# EAGLE schematic RobotBoard_v1.0 (EAGLE 6.1)
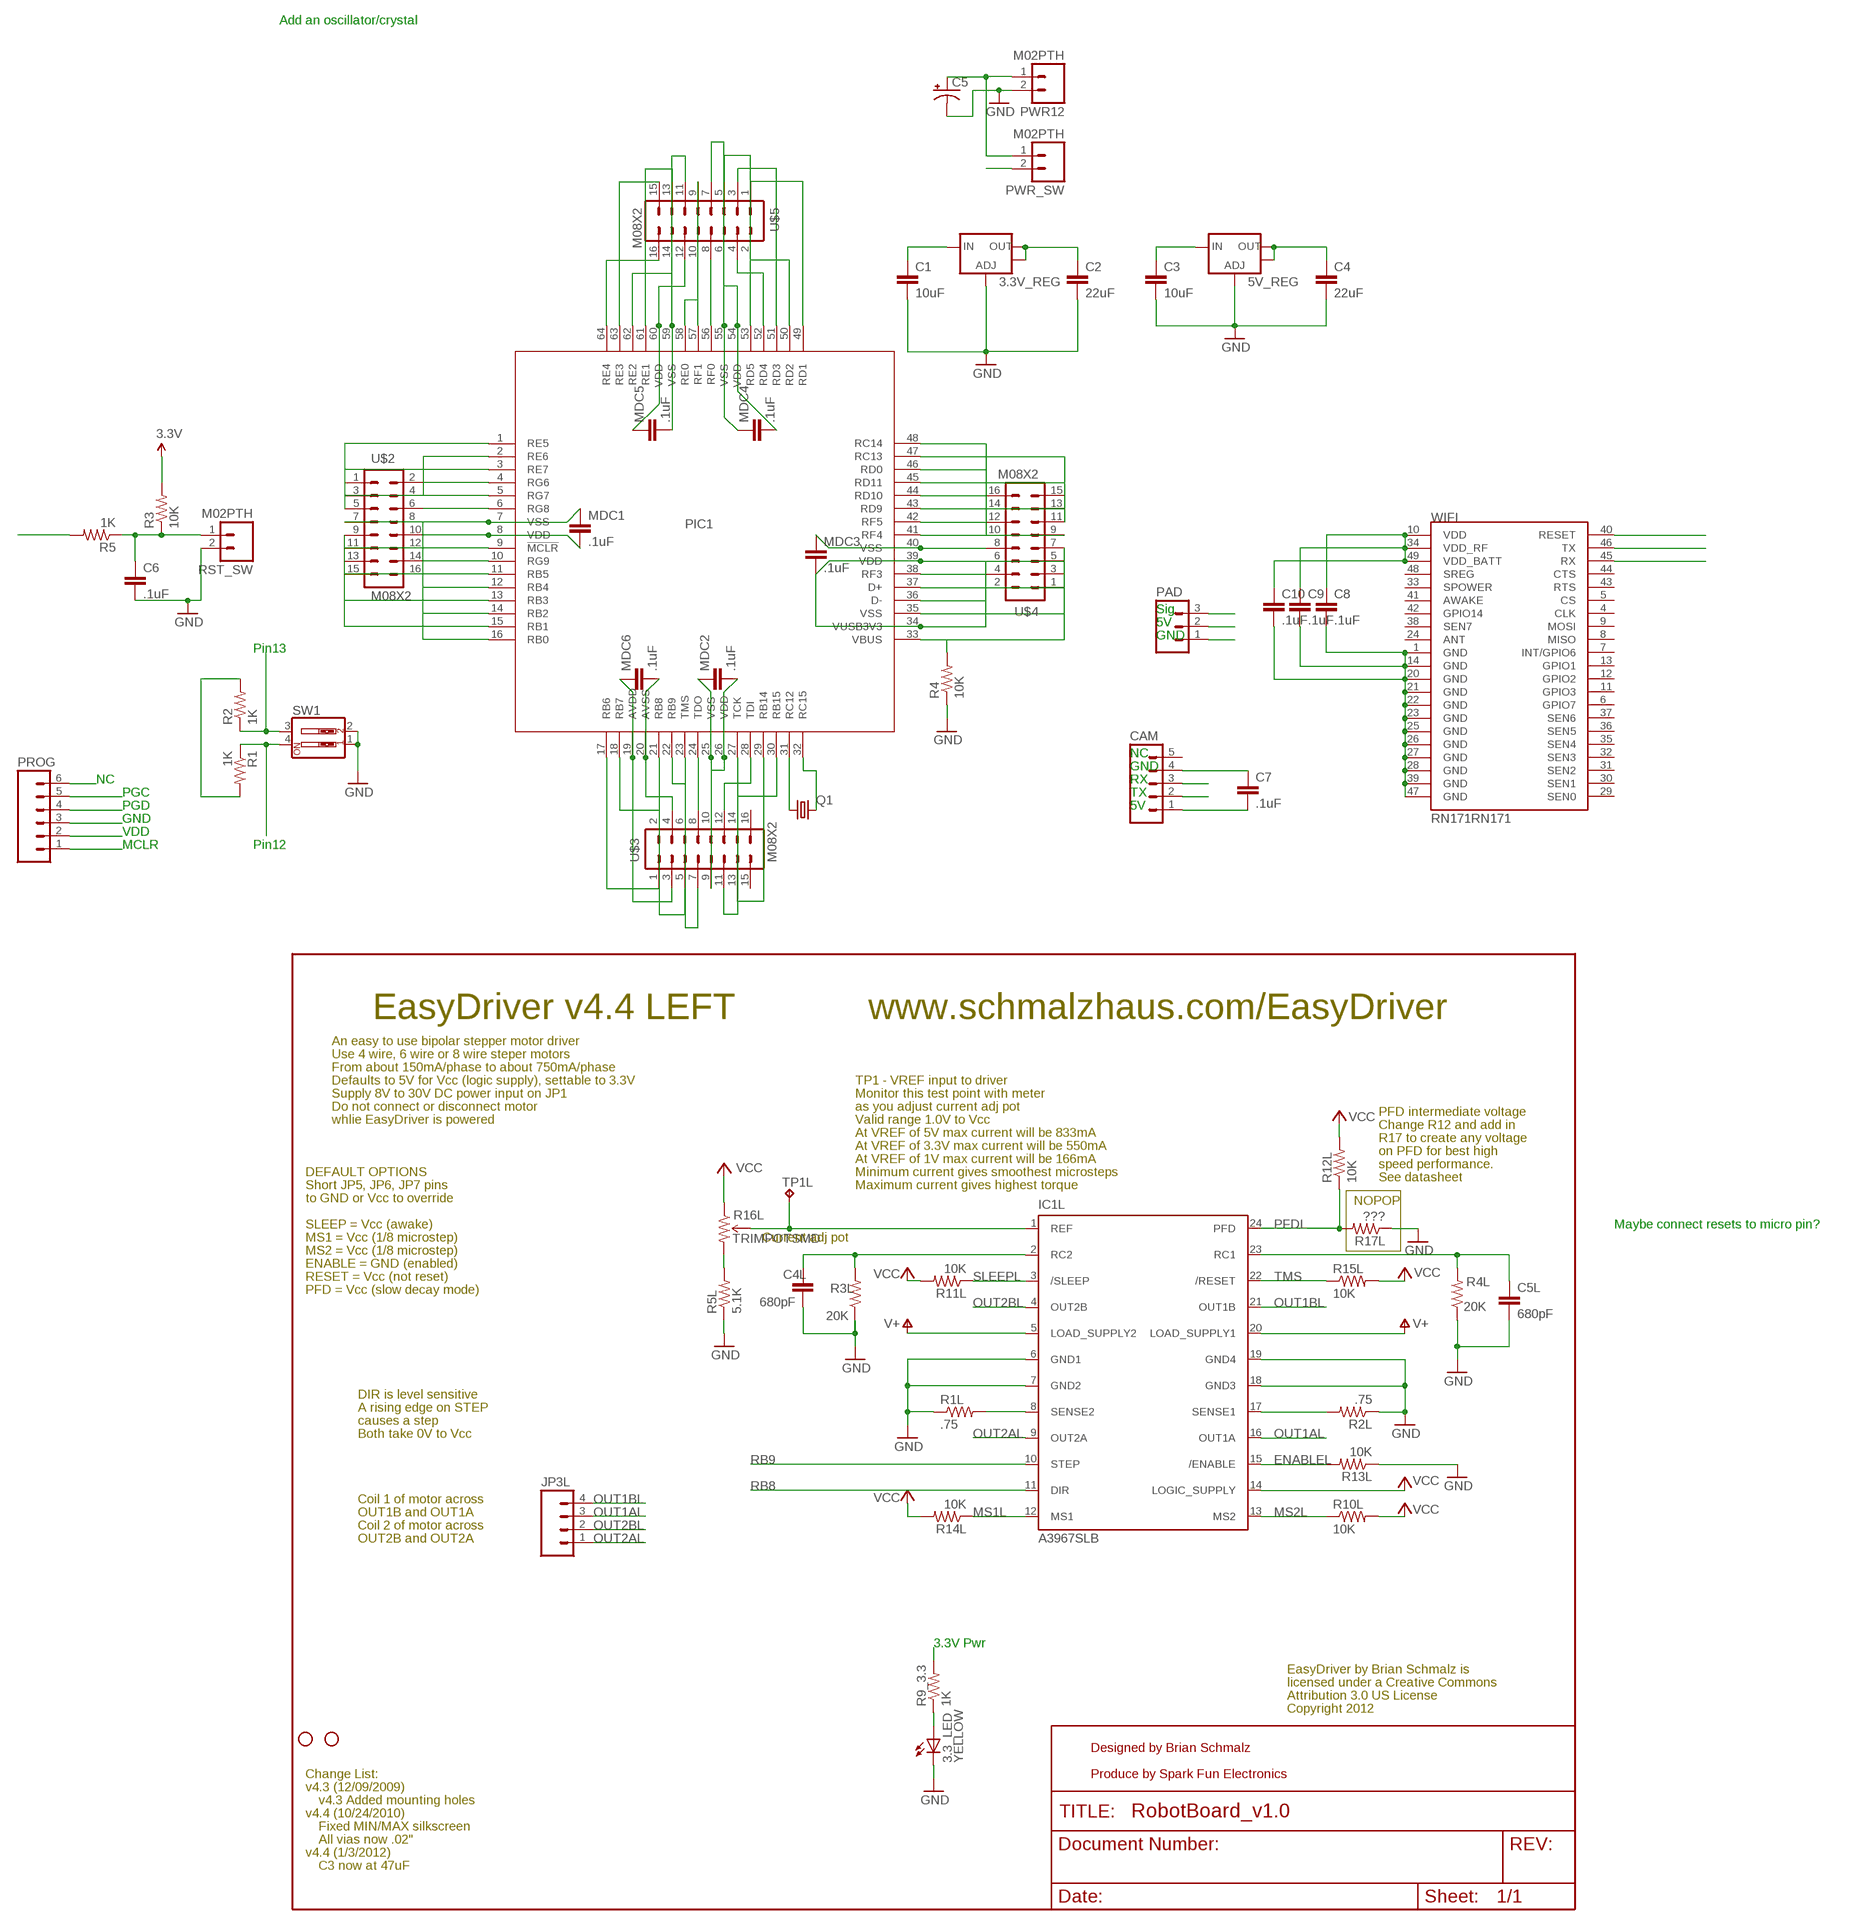
[diagram p0: schematic, sheet 1, part 1 of 2]
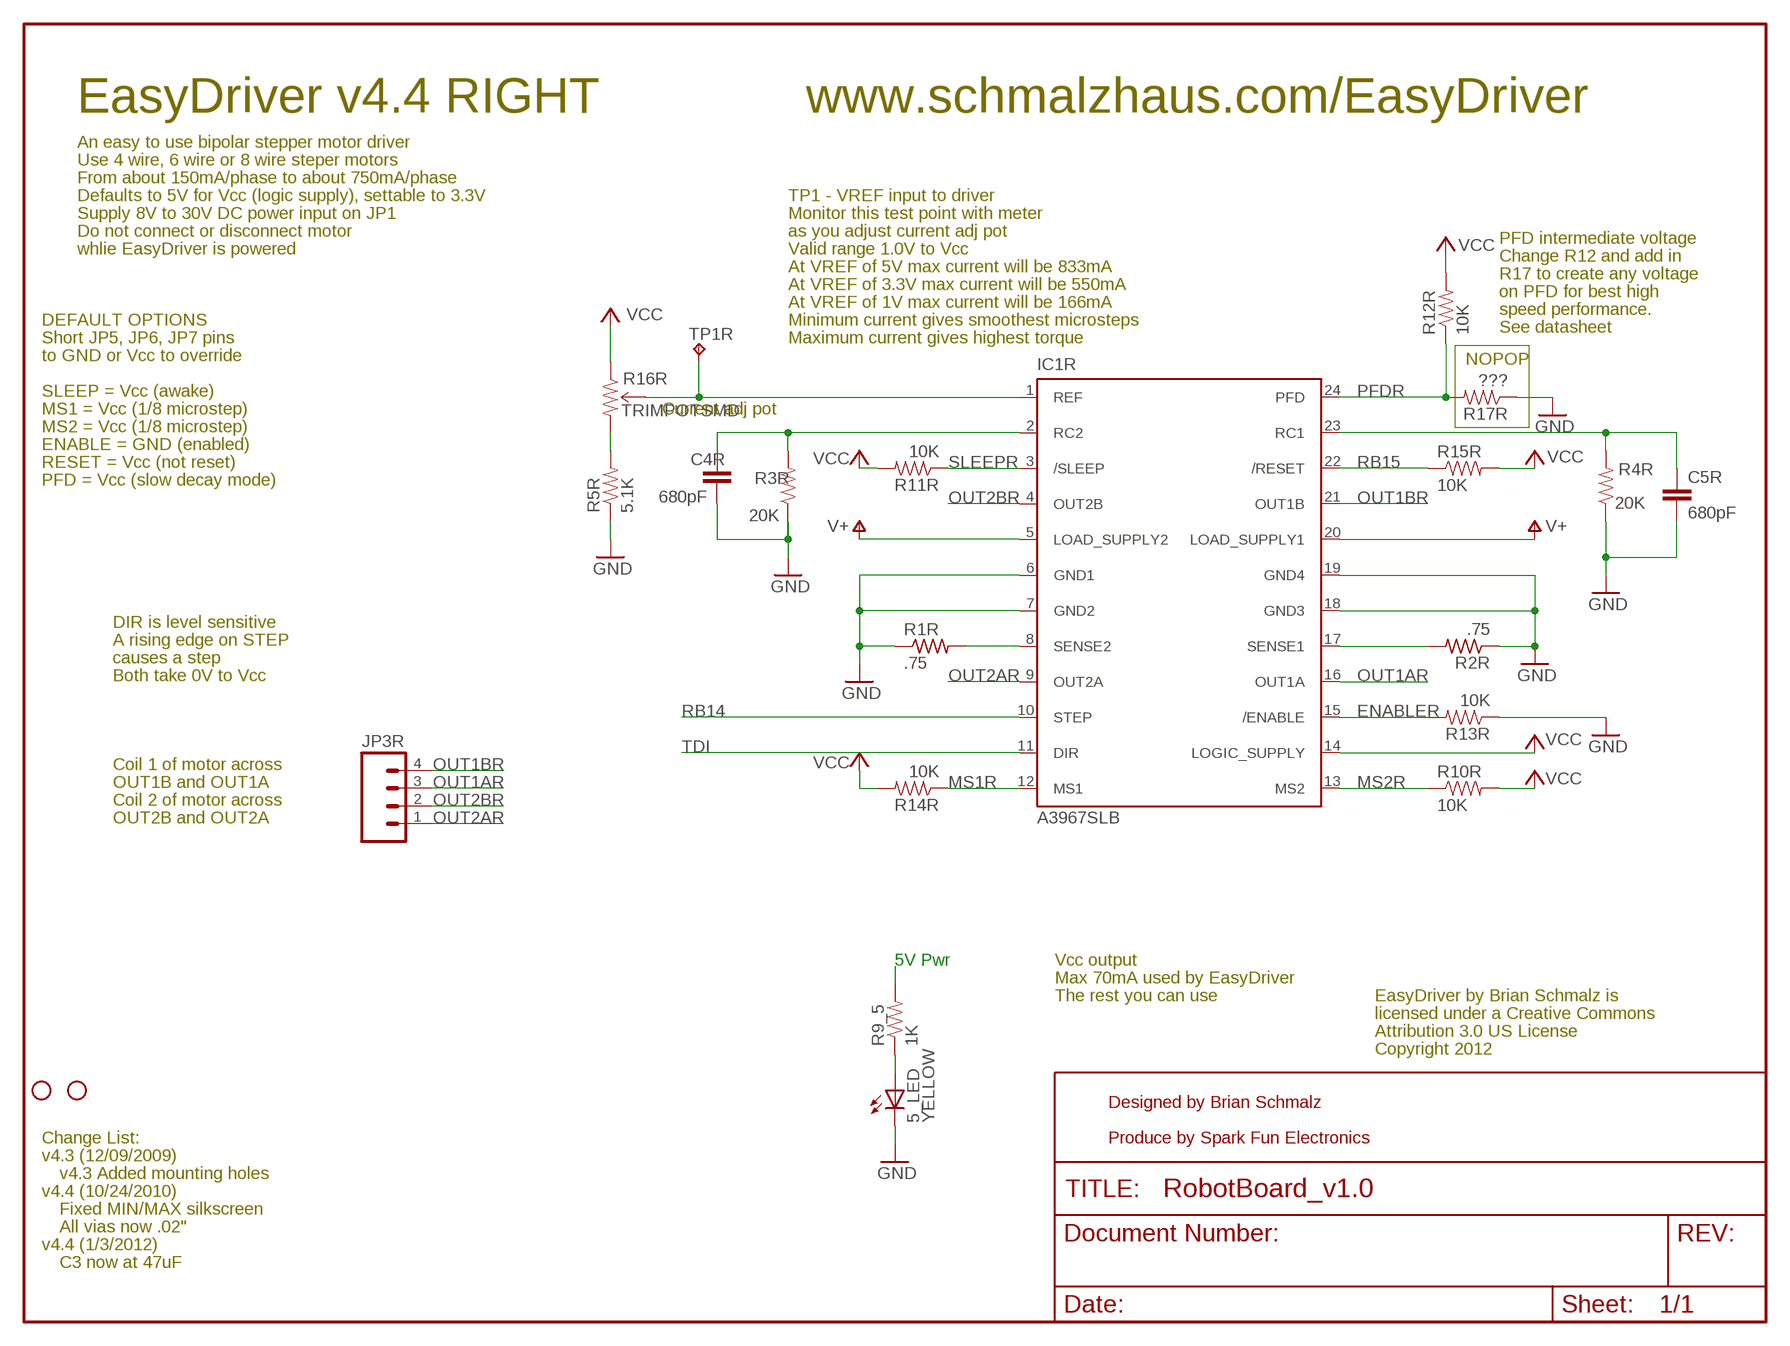
[diagram p1: schematic, sheet 1, part 2 of 2]

## Parts
3.3_LED  YELLOW  LED0603  [LED-0603]
3.3V_REG  V_REG_LM1117SOT223  [SOT223]
5_LED  YELLOW  LED0603  [LED-0603]
5V_REG  V_REG_LM1117SOT223  [SOT223]
C1  10uF  CAP0603  [0603]
C2  22uF  CAP0603  [0603]
C3  10uF  CAP0603  [0603]
C4  22uF  CAP0603  [0603]
C4L  680pF  CAP0402  [C0402]
C4R  680pF  CAP0402  [C0402]
C5  CAP_POLPTH4  [CPOL-RADIAL-1000UF-25V]
C5L  680pF  CAP0402  [C0402]
C5R  680pF  CAP0402  [C0402]
C6  .1uF  CAP0603  [0603]
C7  .1uF  CAP0603  [0603]
C8  .1uF  CAP0603  [0603]
C9  .1uF  CAP0603  [0603]
C10  .1uF  CAP0603  [0603]
CAM  M05LOCK  [1X05_LOCK]
IC1L  A3967SLB  [SO24W]
IC1R  A3967SLB  [SO24W]
JP1  STAND-OFF  [STAND-OFF]
JP2  STAND-OFF  [STAND-OFF]
JP3L  M041X04_NO_SILK  [1X04_NO_SILK]
JP3R  M041X04_NO_SILK  [1X04_NO_SILK]
JP8  STAND-OFF  [STAND-OFF]
JP9  STAND-OFF  [STAND-OFF]
MDC1  .1uF  CAP0603  [0603]
MDC2  .1uF  CAP0603  [0603]
MDC3  .1uF  CAP0603  [0603]
MDC4  .1uF  CAP0603  [0603]
MDC5  .1uF  CAP0603  [0603]
MDC6  .1uF  CAP0603  [0603]
PAD  M03POLAR  [MOLEX-1X3]
PIC1  PIC32MZ2048ECM064  [TQFP64-10X10X1MM]
PROG  M06LOCK  [1X06_LOCK]
PWR12  M02PTH  [1X02]
PWR_SW  M02PTH  [1X02]
Q1  CRYSTALHC49UP  [HC49UP]
R1  1K  RESISTOR0402  [C0402]
R1L  .75  R-US_R0805  [R0805]
R1R  .75  R-US_R0805  [R0805]
R2  1K  RESISTOR0402  [C0402]
R2L  .75  R-US_R0805  [R0805]
R2R  .75  R-US_R0805  [R0805]
R3  10K  RESISTOR0402  [C0402]
R3L  20K  RESISTOR0402  [C0402]
R3R  20K  RESISTOR0402  [C0402]
R4  10K  RESISTOR0402  [C0402]
R4L  20K  RESISTOR0402  [C0402]
R4R  20K  RESISTOR0402  [C0402]
R5  1K  RESISTOR0402  [C0402]
R5L  5.1K  RESISTOR0402  [C0402]
R5R  5.1K  RESISTOR0402  [C0402]
R9_3.3  1K  RESISTOR0402  [C0402]
R9_5  1K  RESISTOR0402  [C0402]
R10L  10K  RESISTOR0402  [C0402]
R10R  10K  RESISTOR0402  [C0402]
R11L  10K  RESISTOR0402  [C0402]
R11R  10K  RESISTOR0402  [C0402]
R12L  10K  RESISTOR0402  [C0402]
R12R  10K  RESISTOR0402  [C0402]
R13L  10K  RESISTOR0402  [C0402]
R13R  10K  RESISTOR0402  [C0402]
R14L  10K  RESISTOR0402  [C0402]
R14R  10K  RESISTOR0402  [C0402]
R15L  10K  RESISTOR0402  [C0402]
R15R  10K  RESISTOR0402  [C0402]
R16L  TRIMPOTSMD  [TRIMPOT-3MM]
R16R  TRIMPOTSMD  [TRIMPOT-3MM]
R17L  ???  RESISTOR0402  [C0402]
R17R  ???  RESISTOR0402  [C0402]
RST_SW  M02PTH  [1X02]
SW1  SW_DIP-2  [DIPSWITCH-02]
TP1L  TPPAD1-13  [P1-13]
TP1R  TPPAD1-13  [P1-13]
U$2  M08X2  [2X8]
U$3  M08X2  [2X8]
U$4  M08X2  [2X8]
U$5  M08X2  [2X8]
WIFI  RN171RN171  [RN171]

## Nets
3.3V: 3.3V_REG.2(OUT) 3.3V_REG.4(OUT) C2.1 C8.1 C9.1 C10.1 IC1L.14(LOGIC_SUPPLY) IC1R.14(LOGIC_SUPPLY) MDC1.2 MDC2.2 MDC3.2 MDC4.2 MDC5.1 MDC6.1 PIC1.8(VDD) PIC1.19(AVDD) PIC1.26(VDD) PIC1.34(VUSB3V3) PIC1.39(VDD) PIC1.54(VDD) PIC1.60(VDD) PROG.2 R1.2 R2.2 R3.2 R9_3.3.2 R10L.2 R10R.2 R11L.2 R11R.2 R12L.2 R12R.2 R14L.2 R14R.2 R15L.2 R15R.2 R16L.1(CCW) R16R.1(CCW) U$2.8 U$3.3 U$3.10 U$4.2 U$4.7 U$5.6 U$5.12 WIFI.10(VDD) WIFI.34(VDD_RF) WIFI.49(VDD_BATT) ; supply symbol labelled VCC
5V: 5V_REG.2(OUT) 5V_REG.4(OUT) C4.1 C7.2 CAM.1 PAD.2 R9_5.2
12V: 3.3V_REG.3(IN) 5V_REG.3(IN) C1.1 C3.1 IC1L.5(LOAD_SUPPLY2) IC1L.20(LOAD_SUPPLY1) IC1R.5(LOAD_SUPPLY2) IC1R.20(LOAD_SUPPLY1) PWR_SW.2 ; supply symbol labelled V+
!MCLR: PIC1.9(!MCLR) PROG.1 R5.2 U$2.9
A44: C6.1 R3.1 R5.1 RST_SW.1
D+: PIC1.37(D+) U$4.5
D-: PIC1.36(D-) U$4.4
ENABLEL: IC1L.15(/ENABLE) R13L.2
ENABLER: IC1R.15(/ENABLE) R13R.2
GND: 3.3_LED.C 3.3V_REG.1(ADJ) 5_LED.C 5V_REG.1(ADJ) C1.2 C2.2 C3.2 C4.2 C4L.2 C4R.2 C5.2(-) C5L.2 C5R.2 C6.2 C7.1 C8.2 C9.2 C10.2 CAM.4 IC1L.6(GND1) IC1L.7(GND2) IC1L.18(GND3) IC1L.19(GND4) IC1R.6(GND1) IC1R.7(GND2) IC1R.18(GND3) IC1R.19(GND4) MDC1.1 MDC2.1 MDC3.1 MDC4.1 MDC5.2 MDC6.2 PAD.1 PIC1.7(VSS) PIC1.20(AVSS) PIC1.25(VSS) PIC1.35(VSS) PIC1.40(VSS) PIC1.55(VSS) PIC1.59(VSS) PROG.3 PWR12.2 R1L.1 R1R.1 R2L.1 R2R.1 R3L.1 R3R.1 R4.1 R4L.1 R4R.1 R5L.1 R5R.1 R13L.1 R13R.1 R17L.1 R17R.1 RST_SW.2 SW1.1 SW1.2 U$2.7 U$3.4 U$3.9 U$4.3 U$4.8 U$5.7 U$5.11 WIFI.1(GND) WIFI.14(GND) WIFI.20(GND) WIFI.21(GND) WIFI.22(GND) WIFI.23(GND) WIFI.25(GND) WIFI.26(GND) WIFI.27(GND) WIFI.28(GND) WIFI.39(GND) WIFI.47(GND)
MS1L: IC1L.12(MS1) R14L.1
MS1R: IC1R.12(MS1) R14R.1
MS2L: IC1L.13(MS2) R10L.1
MS2R: IC1R.13(MS2) R10R.1
N$1: IC1L.8(SENSE2) R1L.2
N$2: 3.3_LED.A R9_3.3.1
N$3: IC1L.17(SENSE1) R2L.2
N$5: C4L.1 IC1L.2(RC2) R3L.2
N$6: PIC1.31(RC12) Q1.1
N$7: C5L.1 IC1L.23(RC1) R4L.2
N$8: IC1R.8(SENSE2) R1R.2
N$9: IC1R.17(SENSE1) R2R.2
N$10: C4R.1 IC1R.2(RC2) R3R.2
N$11: R5L.2 R16L.3(CW)
N$12: IC1L.1(REF) R16L.2(WIPER) TP1L.1(TP)
N$13: C5R.1 IC1R.23(RC1) R4R.2
N$14: IC1R.1(REF) R16R.2(WIPER) TP1R.1(TP)
N$15: PIC1.32(RC15) Q1.2
N$16: R5R.2 R16R.3(CW)
N$17: 5_LED.A R9_5.1
N$19: C5.1(+) PWR12.1 PWR_SW.1
N$34: PROG.6
OUT1AL: IC1L.16(OUT1A) JP3L.3
OUT1AR: IC1R.16(OUT1A) JP3R.3
OUT1BL: IC1L.21(OUT1B) JP3L.4
OUT1BR: IC1R.21(OUT1B) JP3R.4
OUT2AL: IC1L.9(OUT2A) JP3L.1
OUT2AR: IC1R.9(OUT2A) JP3R.1
OUT2BL: IC1L.4(OUT2B) JP3L.2
OUT2BR: IC1R.4(OUT2B) JP3R.2
PFDL: IC1L.24(PFD) R12L.1 R17L.2
PFDR: IC1R.24(PFD) R12R.1 R17R.2
RB0: PIC1.16(RB0) PROG.4 U$2.16
RB1: PIC1.15(RB1) PROG.5 U$2.15
RB2: PIC1.14(RB2) U$2.14
RB3: PIC1.13(RB3) R2.1 SW1.3 U$2.13
RB4: PIC1.12(RB4) R1.1 SW1.4 U$2.12
RB5: PIC1.11(RB5) U$2.11
RB6: PIC1.17(RB6) U$3.1
RB7: PIC1.18(RB7) U$3.2
RB8: IC1L.11(DIR) PIC1.21(RB8) U$3.5
RB9: IC1L.10(STEP) PIC1.22(RB9) U$3.6
RB14: IC1R.10(STEP) PIC1.29(RB14) U$3.13
RB15: IC1R.22(/RESET) PIC1.30(RB15) R15R.1 U$3.14
RC13: PIC1.47(RC13) U$4.15
RC14: PIC1.48(RC14) U$4.16
RD0: CAM.3 PIC1.46(RD0) U$4.14
RD1: PIC1.49(RD1) U$5.1
RD2: PIC1.50(RD2) U$5.2
RD3: PIC1.51(RD3) U$5.3
RD4: PIC1.52(RD4) U$5.4
RD5: PIC1.53(RD5) U$5.5
RD9: CAM.2 PIC1.43(RD9) U$4.11
RD10: PIC1.44(RD10) U$4.12
RD11: PIC1.45(RD11) U$4.13
RE0: PIC1.58(RE0) U$5.10
RE1: PIC1.61(RE1) U$5.13
RE2: PIC1.62(RE2) U$5.14
RE3: PIC1.63(RE3) U$5.15
RE4: PIC1.64(RE4) U$5.16
RE5: PIC1.1(RE5) U$2.1
RE6: PIC1.2(RE6) U$2.2
RE7: PIC1.3(RE7) U$2.3
RF0: PIC1.56(RF0) U$5.8
RF1: PIC1.57(RF1) U$5.9
RF3: PAD.3 PIC1.38(RF3) U$4.6
RF4: PIC1.41(RF4) U$4.9
RF5: PIC1.42(RF5) U$4.10
RG6: PIC1.4(RG6) U$2.4 WIFI.40(RESET)
RG7: PIC1.5(RG7) U$2.5 WIFI.45(RX)
RG8: PIC1.6(RG8) U$2.6 WIFI.46(TX)
RG9: PIC1.10(RG9) U$2.10
SLEEPL: IC1L.3(/SLEEP) R11L.1
SLEEPR: IC1R.3(/SLEEP) R11R.1
TCK: PIC1.27(TCK) U$3.11
TDD: PIC1.24(TDO) U$3.8
TDI: IC1R.11(DIR) PIC1.28(TDI) U$3.12
TMS: IC1L.22(/RESET) PIC1.23(TMS) R15L.1 U$3.7
VBUS: PIC1.33(VBUS) R4.2 U$4.1
Unconnected: CAM.5 U$3.15 U$3.16 WIFI.4(CLK) WIFI.5(CS) WIFI.6(GPIO7) WIFI.7(INT/GPIO6) WIFI.8(MISO) WIFI.9(MOSI) WIFI.11(GPIO3) WIFI.12(GPIO2) WIFI.13(GPIO1) WIFI.24(ANT) WIFI.29(SEN0) WIFI.30(SEN1) WIFI.31(SEN2) WIFI.32(SEN3) WIFI.33(SPOWER) WIFI.35(SEN4) WIFI.36(SEN5) WIFI.37(SEN6) WIFI.38(SEN7) WIFI.41(AWAKE) WIFI.42(GPIO14) WIFI.43(RTS) WIFI.44(CTS) WIFI.48(SREG)

## Notes on the sheet
- Add an oscillator/crystal
- Sig
- 5V
- GND
- Pin13
- NC
- GND
- NC | RX
- PGC | TX
- PGD | 5V
- GND
- VDD
- MCLR | Pin12
- EasyDriver v4.4 LEFT | www.schmalzhaus.com/EasyDriver
- An easy to use bipolar stepper motor driver
- Use 4 wire, 6 wire or 8 wire steper motors
- From about 150mA/phase to about 750mA/phase
- Defaults to 5V for Vcc (logic supply), settable to 3.3V | TP1 - VREF input to driver
- Supply 8V to 30V DC power input on JP1 | Monitor this test point with meter
- Do not connect or disconnect motor | as you adjust current adj pot
- PFD intermediate voltage
- whlie EasyDriver is powered | Valid range 1.0V to Vcc
- Change R12 and add in
- At VREF of 5V max current will be 833mA
- R17 to create any voltage
- At VREF of 3.3V max current will be 550mA
- on PFD for best high
- At VREF of 1V max current will be 166mA
- speed performance.
- DEFAULT OPTIONS | Minimum current gives smoothest microsteps
- See datasheet
- Short JP5, JP6, JP7 pins | Maximum current gives highest torque
- to GND or Vcc to override | NOPOP
- SLEEP = Vcc (awake) | Maybe connect resets to micro pin?
- MS1 = Vcc (1/8 microstep) | Current adj pot
- MS2 = Vcc (1/8 microstep)
- ENABLE = GND (enabled)
- RESET = Vcc (not reset)
- PFD = Vcc (slow decay mode)
- DIR is level sensitive
- A rising edge on STEP
- causes a step
- Both take 0V to Vcc
- Coil 1 of motor across
- OUT1B and OUT1A
- Coil 2 of motor across
- OUT2B and OUT2A
- 3.3V Pwr
- EasyDriver by Brian Schmalz is
- licensed under a Creative Commons
- Attribution 3.0 US License
- Copyright 2012
- Designed by Brian Schmalz
- Change List: | Produce by Spark Fun Electronics
- v4.3 (12/09/2009)
- v4.3 Added mounting holes
- v4.4 (10/24/2010)
- Fixed MIN/MAX silkscreen
- All vias now .02"
- v4.4 (1/3/2012)
- C3 now at 47uF
- EasyDriver v4.4 RIGHT | www.schmalzhaus.com/EasyDriver
- An easy to use bipolar stepper motor driver
- Use 4 wire, 6 wire or 8 wire steper motors
- From about 150mA/phase to about 750mA/phase
- Defaults to 5V for Vcc (logic supply), settable to 3.3V | TP1 - VREF input to driver
- Supply 8V to 30V DC power input on JP1 | Monitor this test point with meter
- Do not connect or disconnect motor | as you adjust current adj pot
- PFD intermediate voltage
- whlie EasyDriver is powered | Valid range 1.0V to Vcc
- Change R12 and add in
- At VREF of 5V max current will be 833mA
- R17 to create any voltage
- At VREF of 3.3V max current will be 550mA
- on PFD for best high
- At VREF of 1V max current will be 166mA
- speed performance.
- DEFAULT OPTIONS | Minimum current gives smoothest microsteps
- See datasheet
- Short JP5, JP6, JP7 pins | Maximum current gives highest torque
- to GND or Vcc to override | NOPOP
- SLEEP = Vcc (awake)
- MS1 = Vcc (1/8 microstep) | Current adj pot
- MS2 = Vcc (1/8 microstep)
- ENABLE = GND (enabled)
- RESET = Vcc (not reset)
- PFD = Vcc (slow decay mode)
- DIR is level sensitive
- A rising edge on STEP
- causes a step
- Both take 0V to Vcc
- Coil 1 of motor across
- OUT1B and OUT1A
- Coil 2 of motor across
- OUT2B and OUT2A
- 5V Pwr | Vcc output
- Max 70mA used by EasyDriver
- The rest you can use | EasyDriver by Brian Schmalz is
- licensed under a Creative Commons
- Attribution 3.0 US License
- Copyright 2012
- Designed by Brian Schmalz
- Change List: | Produce by Spark Fun Electronics
- v4.3 (12/09/2009)
- v4.3 Added mounting holes
- v4.4 (10/24/2010)
- Fixed MIN/MAX silkscreen
- All vias now .02"
- v4.4 (1/3/2012)
- C3 now at 47uF

## Library data of the parts
3.3_LED 5_LED = SparkFun03_30_09:LED: LEDs Standard schematic elements and footprints for 5mm, 3mm, 1206, and 0603 sized LEDs. 5mm - Spark Fun Electronics SKU : COM-00529 (and others)
3.3V_REG 5V_REG = SparkFun-PowerIC:V_REG_LM1117: Voltage Regulator LM1117 Standard adjustable voltage regulator but in SMD form. Spark Fun Electronics SKU : COM-00595; PROD_ID: VREG-08170
C1-C4 C6-C10 MDC1-MDC6 = SparkFun-2-11-09:CAP: Capacitor Standard 0603 ceramic capacitor, and 0.1" leaded capacitor.
C4L C4R C5L C5R = SparkFun03_30_09:CAP: Capacitor Standard 0603 ceramic capacitor, and 0.1" leaded capacitor.
C5 = SparkFun-Capacitors:CAP_POL: Capacitor Polarized These are standard SMD and PTH capacitors. Normally 10uF, 47uF, and 100uF in electrolytic and tantalum varieties. Always verify the external diameter of the through hole cap, it varies with capacity, voltage, and manufacturer. The EIA devices should be standard.
CAM = SparkFun-Connectors:M05: Header 5 Standard 5-pin 0.1" header. Use with straight break away headers (SKU : PRT-00116), right angle break away headers (PRT-00553), swiss pins (PRT-00743), machine pins (PRT-00117), and female headers (PRT-00115). Molex polarized connector foot print use with SKU : PRT-08230 with associated crimp pins and housings.
IC1L IC1R = Allegro:A3967SLB: ANALOG DEVICES
JP1 JP2 JP8 JP9 = SparkFun-7-28-09:STAND-OFF: Stand Off This is the mechanical footprint for a #4 phillips button head screw. Use the keepout ring to avoid running the screw head into surrounding components. SKU : PRT-00447
JP3L JP3R = SparkFun:M04: Header 4 Standard 4-pin 0.1" header. Use with straight break away headers (SKU : PRT-00116), right angle break away headers (PRT-00553), swiss pins (PRT-00743), machine pins (PRT-00117), and female headers (PRT-00115). Molex polarized connector foot print use with SKU : PRT-08231 with associated crimp pins and housings.
PAD = SparkFun-Connectors:M03: Header 3 Standard 3-pin 0.1" header. Use with straight break away headers (SKU : PRT-00116), right angle break away headers (PRT-00553), swiss pins (PRT-00743), machine pins (PRT-00117), and female headers (PRT-00115). Molex polarized connector foot print use with SKU : PRT-08232 with associated crimp pins and housings.
PIC1 = microchip:PIC32MZ2048ECM064: PIC32MZ2048ECM064 Microchip microcontroller TQFP64 10x10x1
PROG = SparkFun-Connectors:M06: Header 6 Standard 6-pin 0.1" header. Use with straight break away headers (SKU : PRT-00116), right angle break away headers (PRT-00553), swiss pins (PRT-00743), machine pins (PRT-00117), and female headers (PRT-00115). Molex polarized connector foot print use with SKU : PRT-08094 with associated crimp pins and housings. NOTES ON THE VARIANTS LOCK and LOCK_LONGPADS... This footprint was designed to help hold the alignment of a through-hole component (i.e. 6-pin header) while soldering it into place. You may notice that each hole has been shifted either up or down by 0.005 of an inch from it's more standard position (which is a perfectly straight line). This slight alteration caused the pins (the squares in the middle) to touch the edges of the holes. Because they are alternating, it causes a "brace" to hold the component in place. 0.005 has proven to be the perfect amount of "off-center" position when using our standard breakaway headers. Although looks a little odd when you look at the bare footprint, once you have a header in there, the alteration is very hard to notice. Also,if you push a header all the way into place, it is covered up entirely on the bottom side. This idea of altering the position of holes to aid alignment will be further integrated into the Sparkfun Library for other footprints. It can help hold any component with 3 or more connection pins.
PWR12 PWR_SW RST_SW = SparkFun-Connectors:M02: Standard 2-pin 0.1" header. Use with - straight break away headers ( PRT-00116) - right angle break away headers (PRT-00553) - swiss pins (PRT-00743) - machine pins (PRT-00117) - female headers (PRT-00115) Molex polarized connector foot print use with: PRT-08233 with associated crimp pins and housings. 2.54_SCREWTERM for use with PRT-10571. 3.5mm Screw Terminal footprints for PRT-08084 5mm Screw Terminal footprints for use with PRT-08433
Q1 = crystal:CRYSTAL: CRYSTAL; OC_FARNELL: unknown; OC_NEWARK: unknown
R1-R3 R3L R3R R4 R4L R4R R5 R5L R5R R9_3.3 R9_5 R10L R10R R11L R11R R12L R12R R13L R13R R14L R14R R15L R15R R17L R17R = SparkFun03_30_09:RESISTOR: Resistor Basic schematic elements and footprints for 0603, 1206, and PTH 1/10th watt (small) resistors.
R1L R1R R2L R2R = rcl:R-US_: RESISTOR, American symbol
R16L R16R = SparkFun:TRIMPOT
SW1 = SparkFun-Electromechanical:SW_DIP-2: DIP SWITCH
TP1L TP1R = testpad:TP
U$2-U$5 = SparkFun-Connectors:M08X2: .1" headers, two rows of 8 each
WIFI = SparkFun-RF:RN171: WiFi Module